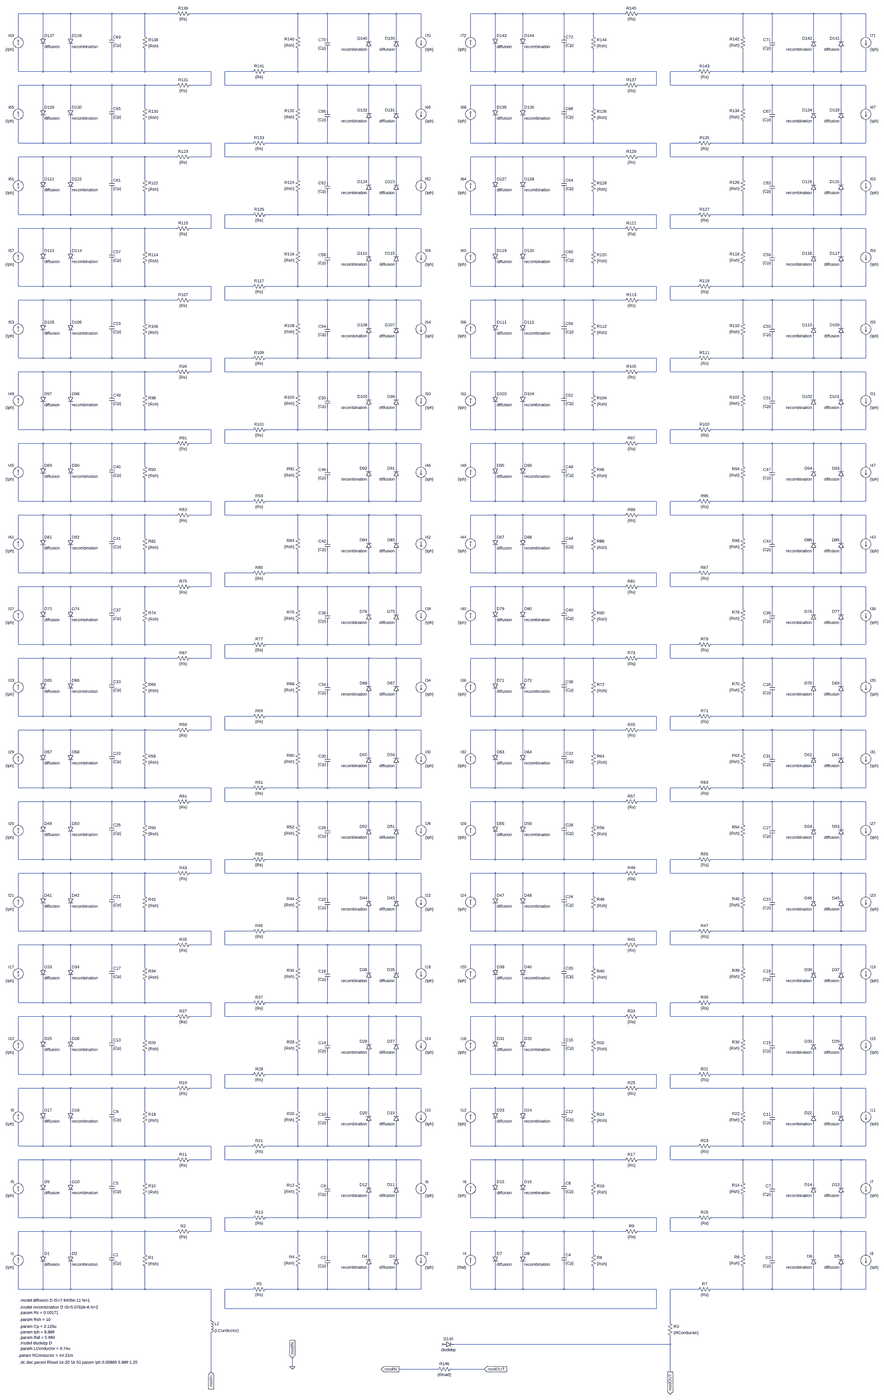
[diagram p0: schematic jacModule-IV.asc, whole sheet]
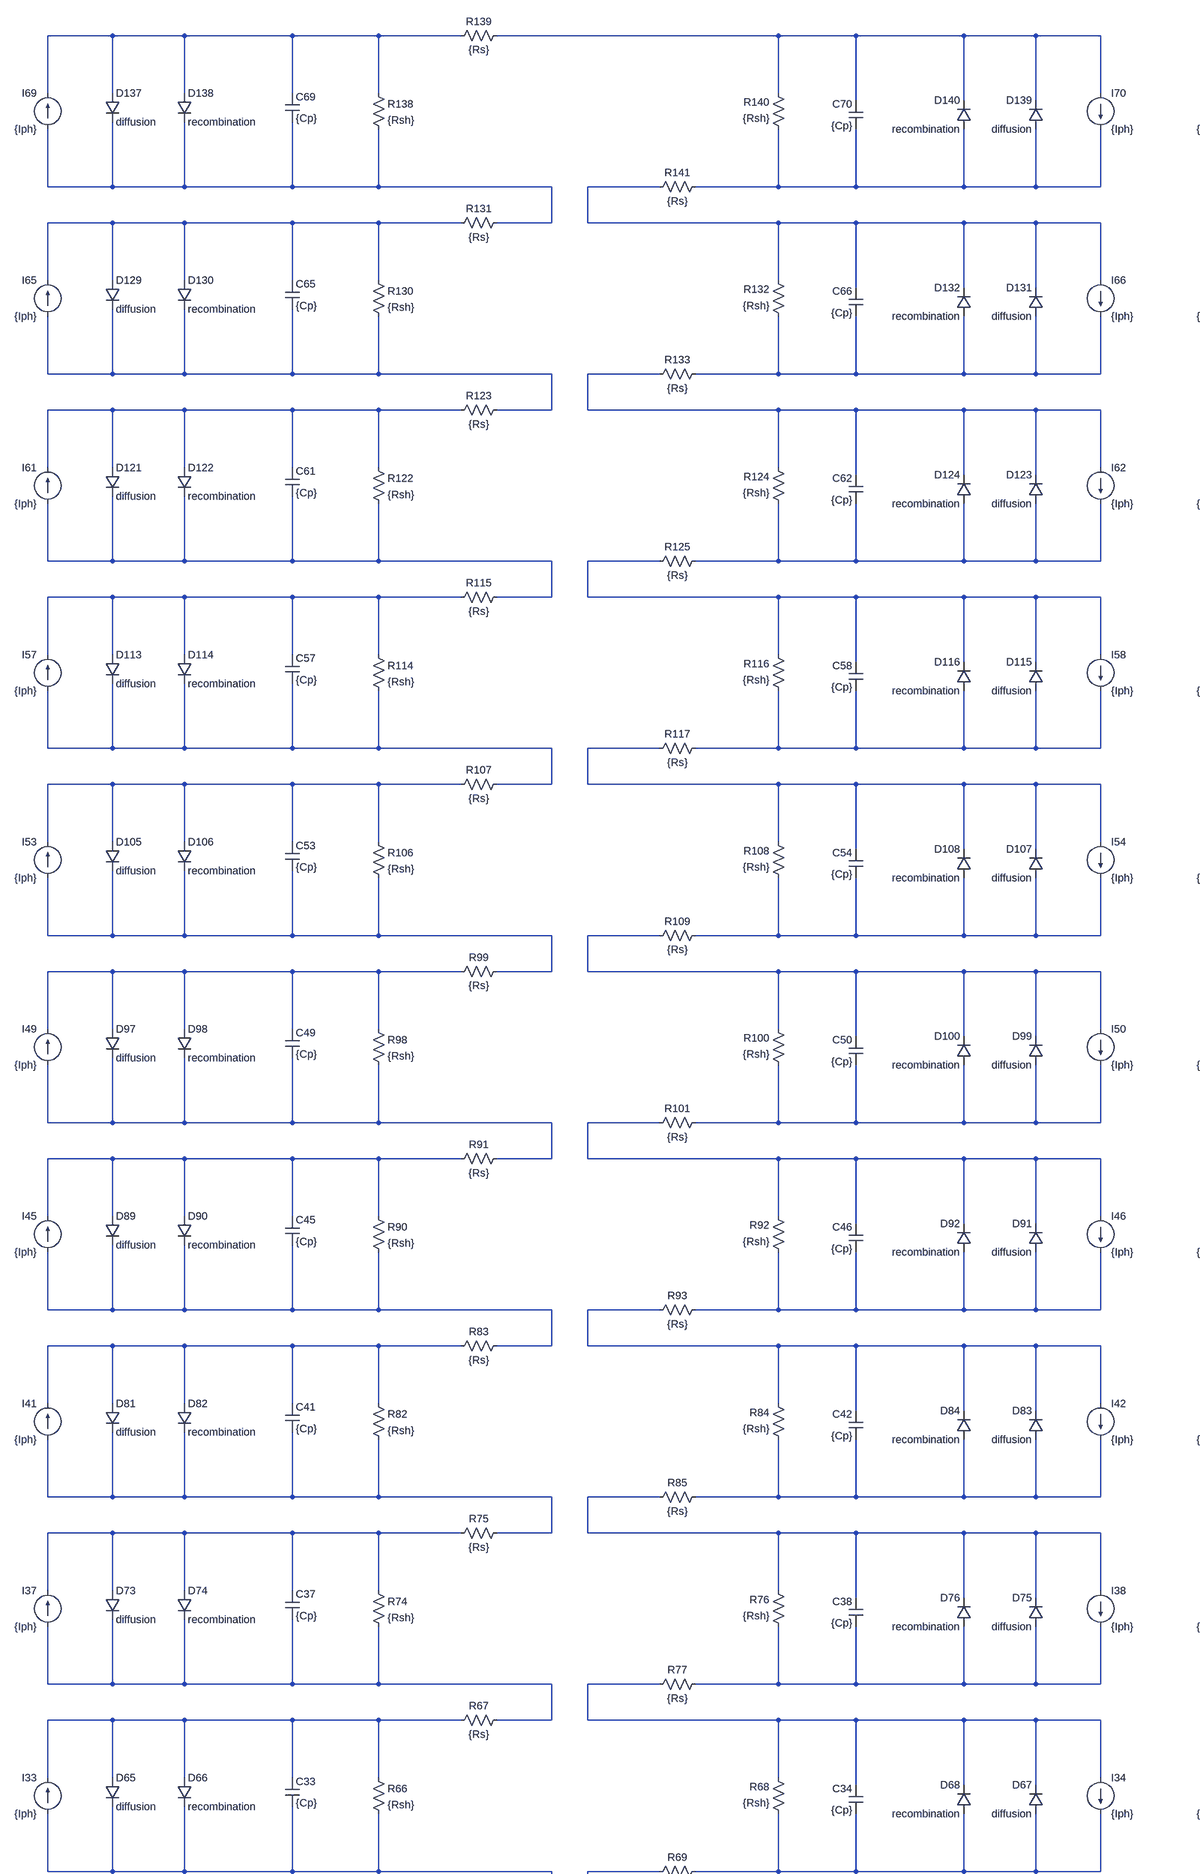
[diagram p1: schematic jacModule-IV.asc, part, row 1 of 2, column 1 of 2]
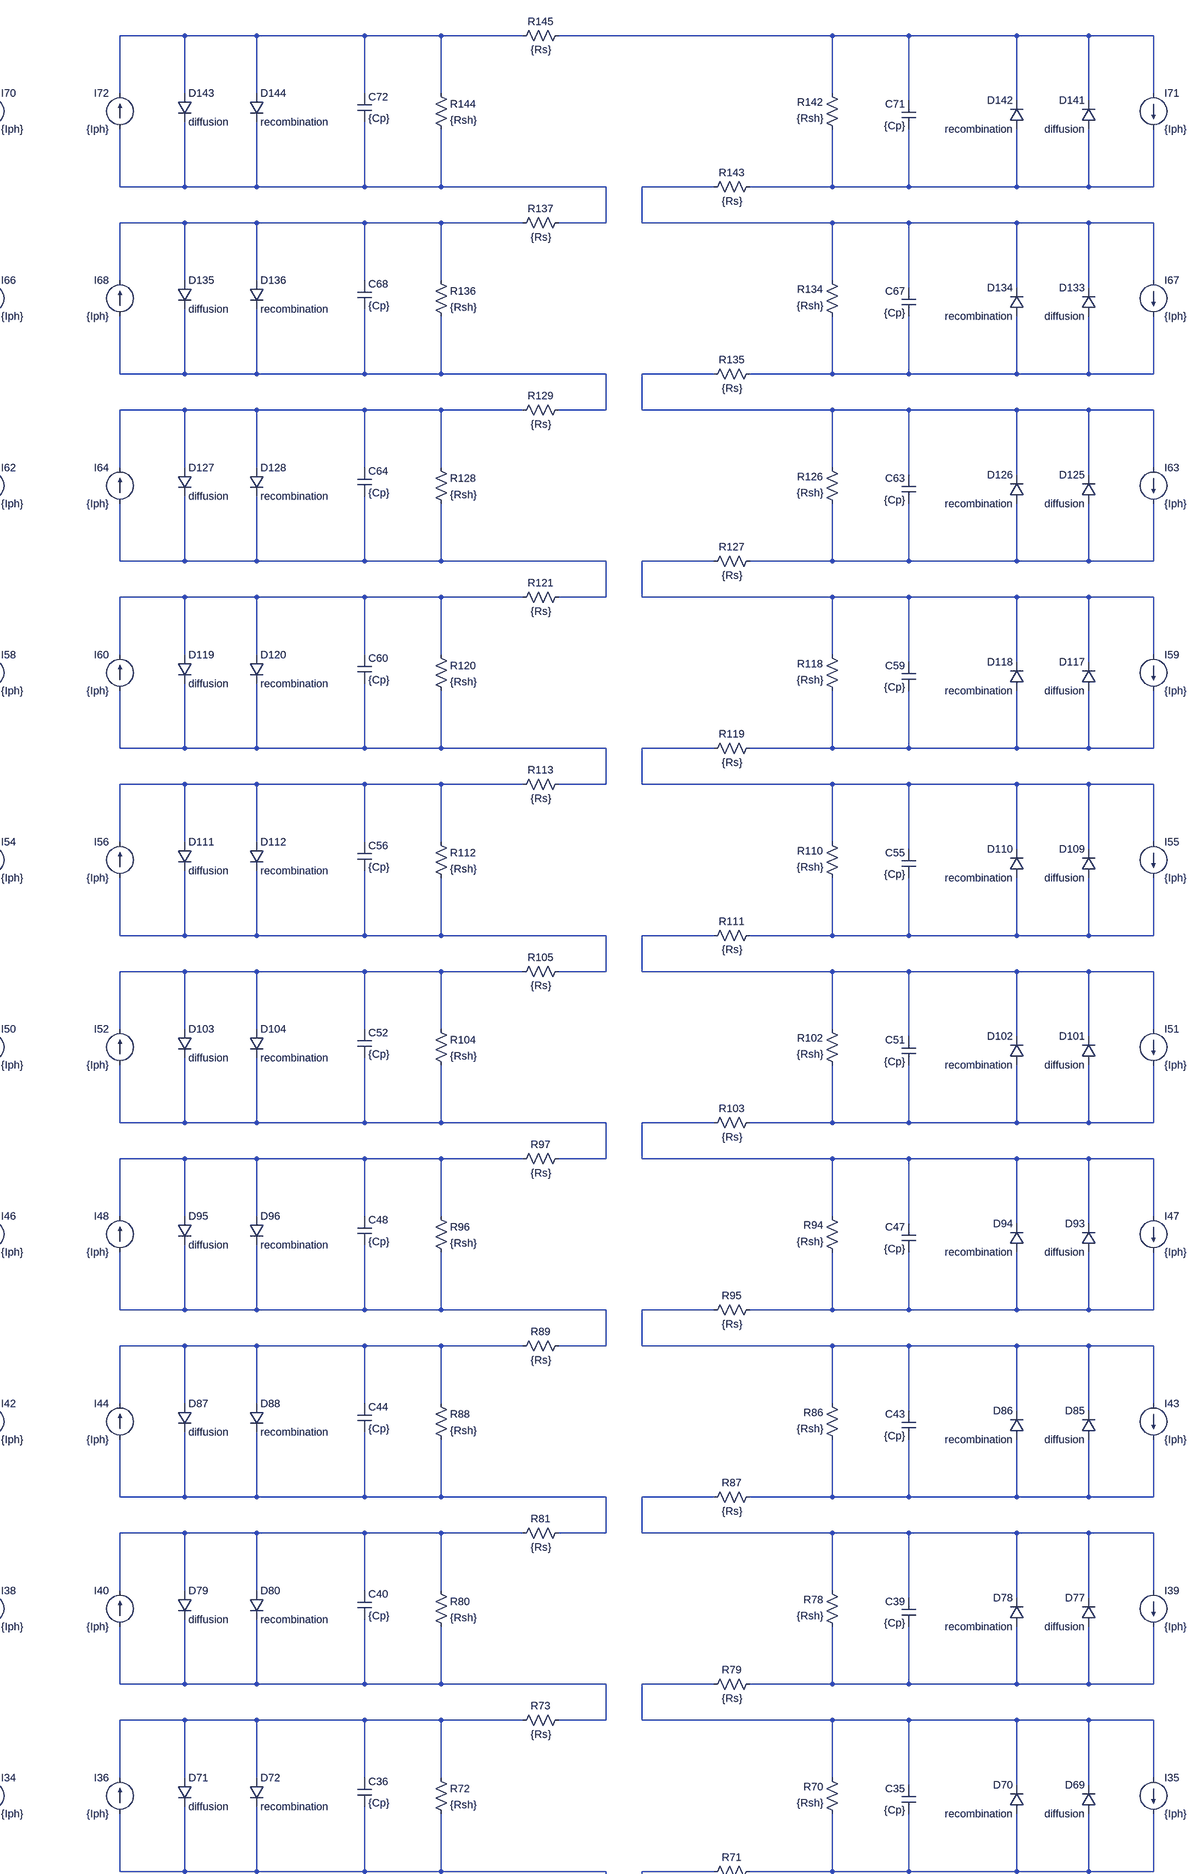
[diagram p2: schematic jacModule-IV.asc, part, row 1 of 2, column 2 of 2]
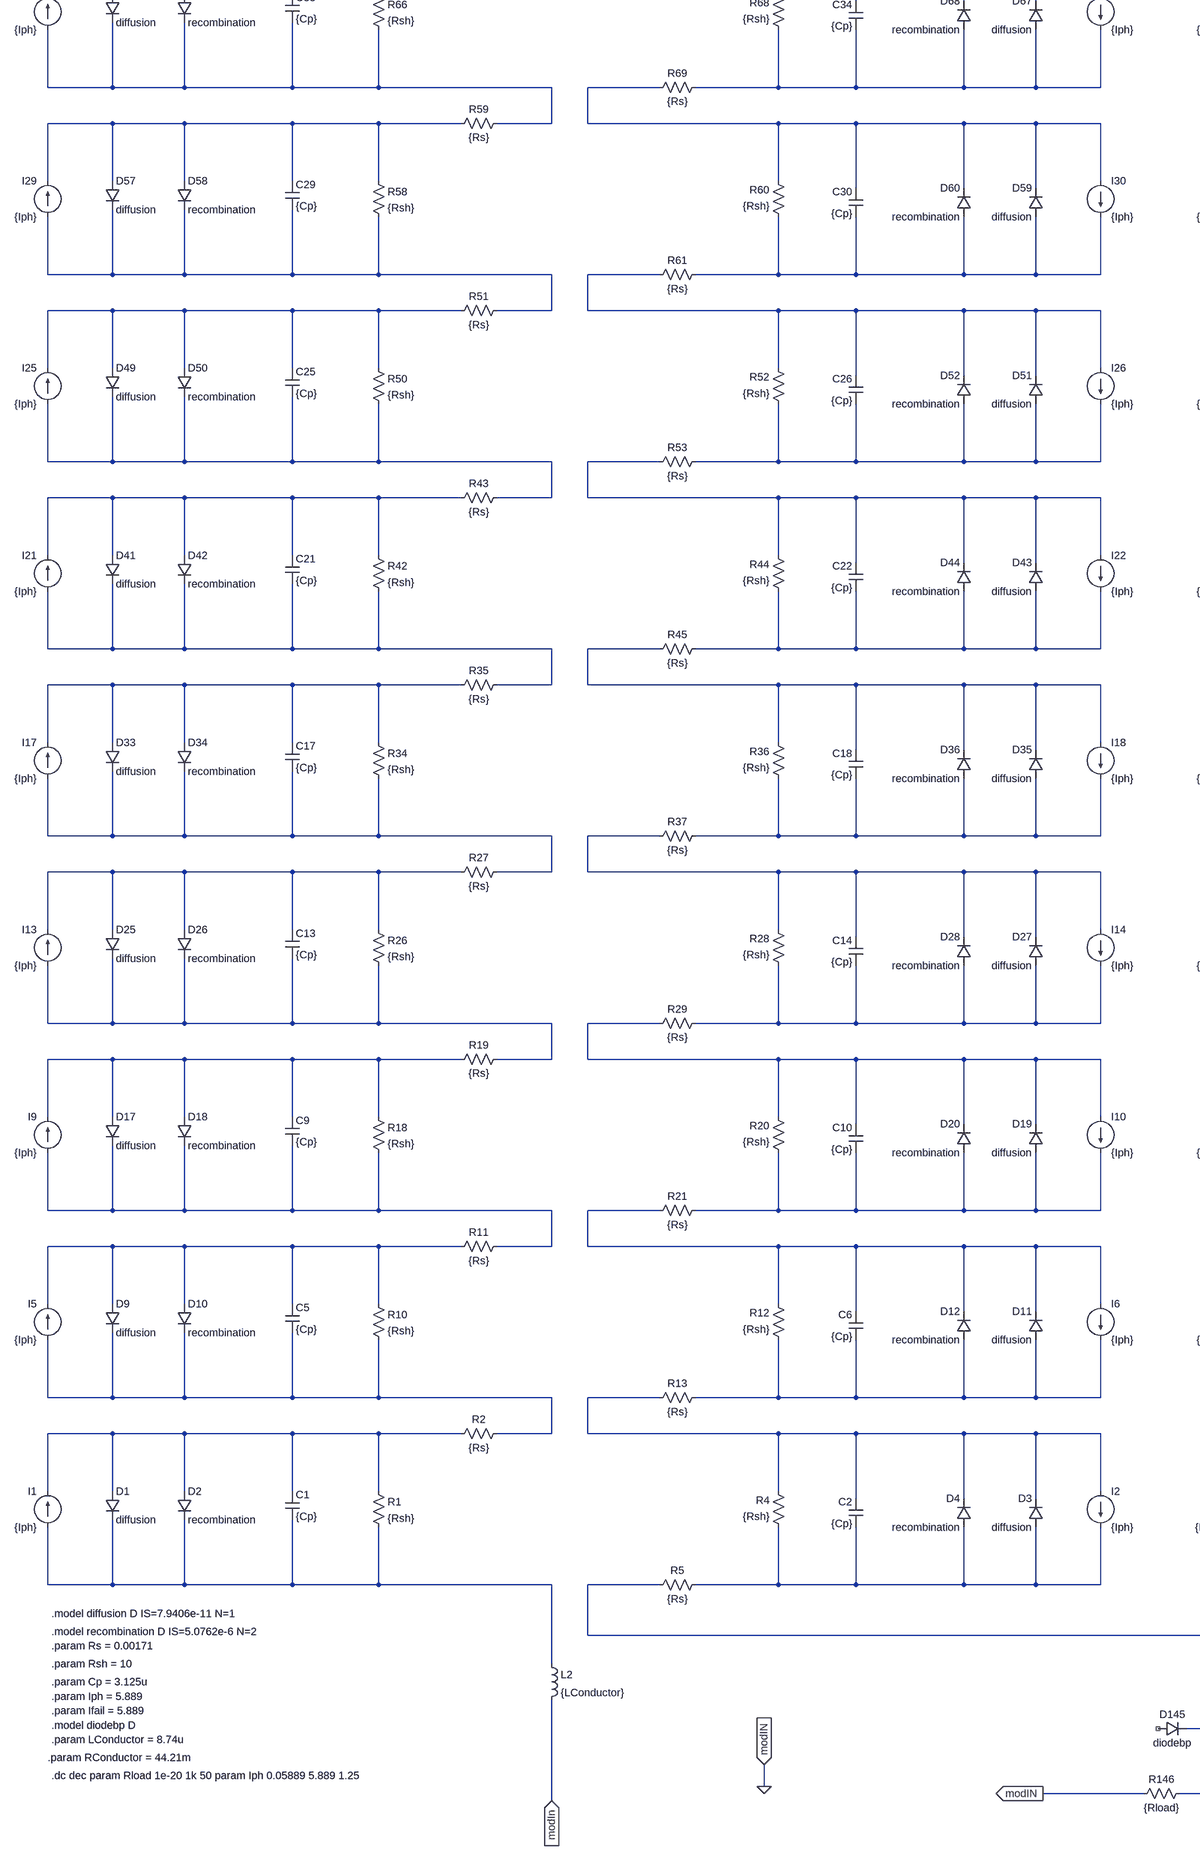
[diagram p3: schematic jacModule-IV.asc, part, row 2 of 2, column 1 of 2]
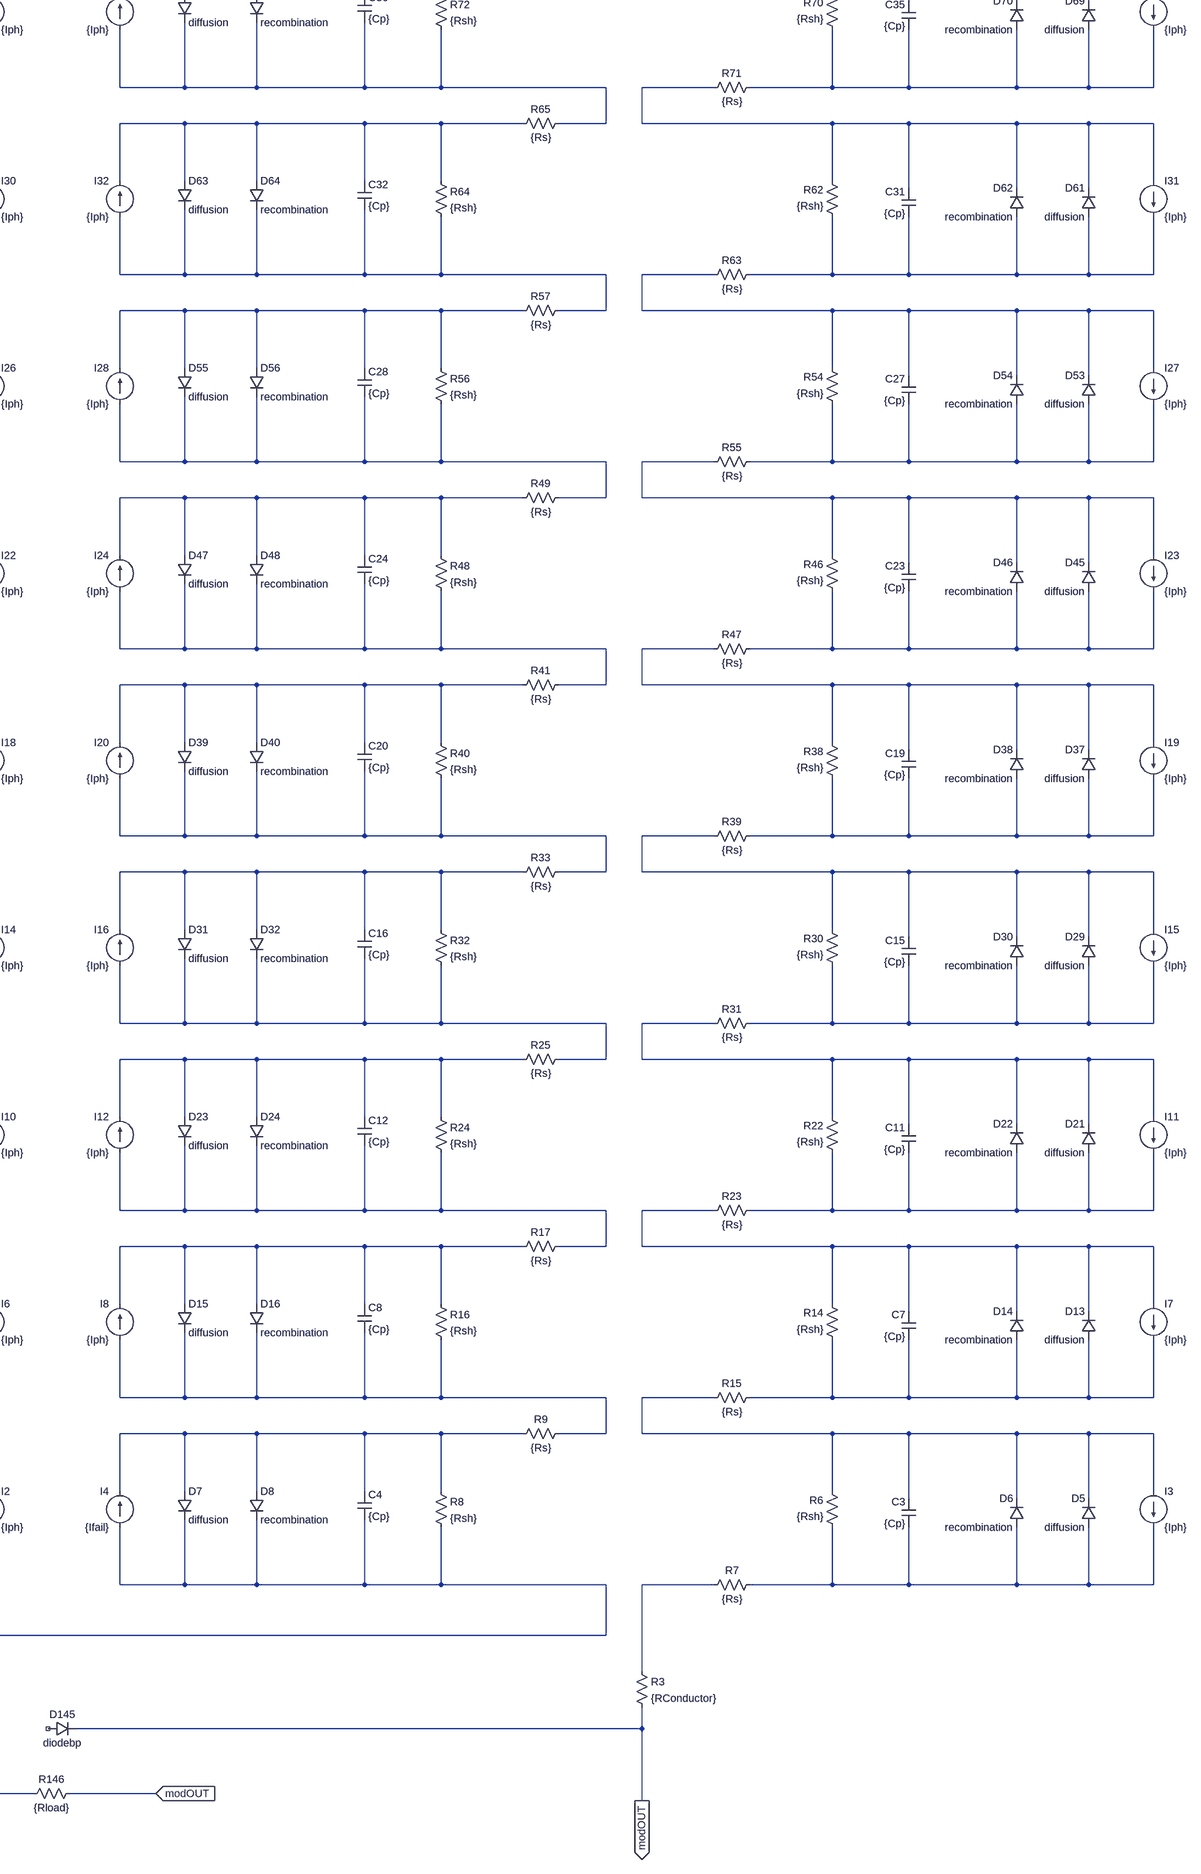
[diagram p4: schematic jacModule-IV.asc, part, row 2 of 2, column 2 of 2]
* jacModule-IV.asc
I1 N141 N139 {Iph}
D1 N139 N141 diffusion
D2 N139 N141 recombination
C1 N139 N141 {Cp}
R1 N139 N141 {Rsh}
R2 N139 N133 {Rs}
I2 N134 N143 {Iph}
D3 N143 N134 diffusion
D4 N143 N134 recombination
C2 N143 N134 {Cp}
R4 N143 N134 {Rsh}
R5 N143 N142 {Rs}
I3 N137 N145 {Iph}
D5 N145 N137 diffusion
D6 N145 N137 recombination
C3 N145 N137 {Cp}
R6 N145 N137 {Rsh}
R7 N145 N144 {Rs}
I4 N142 N140 {Ifail}
D7 N140 N142 diffusion
D8 N140 N142 recombination
C4 N140 N142 {Cp}
R8 N140 N142 {Rsh}
R9 N140 N136 {Rs}
I5 N133 N131 {Iph}
D9 N131 N133 diffusion
D10 N131 N133 recombination
C5 N131 N133 {Cp}
R10 N131 N133 {Rsh}
R11 N131 N125 {Rs}
I6 N126 N135 {Iph}
D11 N135 N126 diffusion
D12 N135 N126 recombination
C6 N135 N126 {Cp}
R12 N135 N126 {Rsh}
R13 N135 N134 {Rs}
I7 N129 N138 {Iph}
D13 N138 N129 diffusion
D14 N138 N129 recombination
C7 N138 N129 {Cp}
R14 N138 N129 {Rsh}
R15 N138 N137 {Rs}
I8 N136 N132 {Iph}
D15 N132 N136 diffusion
D16 N132 N136 recombination
C8 N132 N136 {Cp}
R16 N132 N136 {Rsh}
R17 N132 N128 {Rs}
I9 N125 N123 {Iph}
D17 N123 N125 diffusion
D18 N123 N125 recombination
C9 N123 N125 {Cp}
R18 N123 N125 {Rsh}
R19 N123 N117 {Rs}
I10 N118 N127 {Iph}
D19 N127 N118 diffusion
D20 N127 N118 recombination
C10 N127 N118 {Cp}
R20 N127 N118 {Rsh}
R21 N127 N126 {Rs}
I11 N121 N130 {Iph}
D21 N130 N121 diffusion
D22 N130 N121 recombination
C11 N130 N121 {Cp}
R22 N130 N121 {Rsh}
R23 N130 N129 {Rs}
I12 N128 N124 {Iph}
D23 N124 N128 diffusion
D24 N124 N128 recombination
C12 N124 N128 {Cp}
R24 N124 N128 {Rsh}
R25 N124 N120 {Rs}
I13 N117 N115 {Iph}
D25 N115 N117 diffusion
D26 N115 N117 recombination
C13 N115 N117 {Cp}
R26 N115 N117 {Rsh}
R27 N115 N109 {Rs}
I14 N110 N119 {Iph}
D27 N119 N110 diffusion
D28 N119 N110 recombination
C14 N119 N110 {Cp}
R28 N119 N110 {Rsh}
R29 N119 N118 {Rs}
I15 N113 N122 {Iph}
D29 N122 N113 diffusion
D30 N122 N113 recombination
C15 N122 N113 {Cp}
R30 N122 N113 {Rsh}
R31 N122 N121 {Rs}
I16 N120 N116 {Iph}
D31 N116 N120 diffusion
D32 N116 N120 recombination
C16 N116 N120 {Cp}
R32 N116 N120 {Rsh}
R33 N116 N112 {Rs}
I17 N109 N107 {Iph}
D33 N107 N109 diffusion
D34 N107 N109 recombination
C17 N107 N109 {Cp}
R34 N107 N109 {Rsh}
R35 N107 N101 {Rs}
I18 N102 N111 {Iph}
D35 N111 N102 diffusion
D36 N111 N102 recombination
C18 N111 N102 {Cp}
R36 N111 N102 {Rsh}
R37 N111 N110 {Rs}
I19 N105 N114 {Iph}
D37 N114 N105 diffusion
D38 N114 N105 recombination
C19 N114 N105 {Cp}
R38 N114 N105 {Rsh}
R39 N114 N113 {Rs}
I20 N112 N108 {Iph}
D39 N108 N112 diffusion
D40 N108 N112 recombination
C20 N108 N112 {Cp}
R40 N108 N112 {Rsh}
R41 N108 N104 {Rs}
I21 N101 N099 {Iph}
D41 N099 N101 diffusion
D42 N099 N101 recombination
C21 N099 N101 {Cp}
R42 N099 N101 {Rsh}
R43 N099 N093 {Rs}
I22 N094 N103 {Iph}
D43 N103 N094 diffusion
D44 N103 N094 recombination
C22 N103 N094 {Cp}
R44 N103 N094 {Rsh}
R45 N103 N102 {Rs}
I23 N097 N106 {Iph}
D45 N106 N097 diffusion
D46 N106 N097 recombination
C23 N106 N097 {Cp}
R46 N106 N097 {Rsh}
R47 N106 N105 {Rs}
I24 N104 N100 {Iph}
D47 N100 N104 diffusion
D48 N100 N104 recombination
C24 N100 N104 {Cp}
R48 N100 N104 {Rsh}
R49 N100 N096 {Rs}
I25 N093 N091 {Iph}
D49 N091 N093 diffusion
D50 N091 N093 recombination
C25 N091 N093 {Cp}
R50 N091 N093 {Rsh}
R51 N091 N085 {Rs}
I26 N086 N095 {Iph}
D51 N095 N086 diffusion
D52 N095 N086 recombination
C26 N095 N086 {Cp}
R52 N095 N086 {Rsh}
R53 N095 N094 {Rs}
I27 N089 N098 {Iph}
D53 N098 N089 diffusion
D54 N098 N089 recombination
C27 N098 N089 {Cp}
R54 N098 N089 {Rsh}
R55 N098 N097 {Rs}
I28 N096 N092 {Iph}
D55 N092 N096 diffusion
D56 N092 N096 recombination
C28 N092 N096 {Cp}
R56 N092 N096 {Rsh}
R57 N092 N088 {Rs}
I29 N085 N083 {Iph}
D57 N083 N085 diffusion
D58 N083 N085 recombination
C29 N083 N085 {Cp}
R58 N083 N085 {Rsh}
R59 N083 N077 {Rs}
I30 N078 N087 {Iph}
D59 N087 N078 diffusion
D60 N087 N078 recombination
C30 N087 N078 {Cp}
R60 N087 N078 {Rsh}
R61 N087 N086 {Rs}
I31 N081 N090 {Iph}
D61 N090 N081 diffusion
D62 N090 N081 recombination
C31 N090 N081 {Cp}
R62 N090 N081 {Rsh}
R63 N090 N089 {Rs}
I32 N088 N084 {Iph}
D63 N084 N088 diffusion
D64 N084 N088 recombination
C32 N084 N088 {Cp}
R64 N084 N088 {Rsh}
R65 N084 N080 {Rs}
I33 N077 N075 {Iph}
D65 N075 N077 diffusion
D66 N075 N077 recombination
C33 N075 N077 {Cp}
R66 N075 N077 {Rsh}
R67 N075 N069 {Rs}
I34 N070 N079 {Iph}
D67 N079 N070 diffusion
D68 N079 N070 recombination
C34 N079 N070 {Cp}
R68 N079 N070 {Rsh}
R69 N079 N078 {Rs}
I35 N073 N082 {Iph}
D69 N082 N073 diffusion
D70 N082 N073 recombination
C35 N082 N073 {Cp}
R70 N082 N073 {Rsh}
R71 N082 N081 {Rs}
I36 N080 N076 {Iph}
D71 N076 N080 diffusion
D72 N076 N080 recombination
C36 N076 N080 {Cp}
R72 N076 N080 {Rsh}
R73 N076 N072 {Rs}
I37 N069 N067 {Iph}
D73 N067 N069 diffusion
D74 N067 N069 recombination
C37 N067 N069 {Cp}
R74 N067 N069 {Rsh}
R75 N067 N061 {Rs}
I38 N062 N071 {Iph}
D75 N071 N062 diffusion
D76 N071 N062 recombination
C38 N071 N062 {Cp}
R76 N071 N062 {Rsh}
R77 N071 N070 {Rs}
I39 N065 N074 {Iph}
D77 N074 N065 diffusion
D78 N074 N065 recombination
C39 N074 N065 {Cp}
R78 N074 N065 {Rsh}
R79 N074 N073 {Rs}
I40 N072 N068 {Iph}
D79 N068 N072 diffusion
D80 N068 N072 recombination
C40 N068 N072 {Cp}
R80 N068 N072 {Rsh}
R81 N068 N064 {Rs}
I41 N061 N059 {Iph}
D81 N059 N061 diffusion
D82 N059 N061 recombination
C41 N059 N061 {Cp}
R82 N059 N061 {Rsh}
R83 N059 N053 {Rs}
I42 N054 N063 {Iph}
D83 N063 N054 diffusion
D84 N063 N054 recombination
C42 N063 N054 {Cp}
R84 N063 N054 {Rsh}
R85 N063 N062 {Rs}
I43 N057 N066 {Iph}
D85 N066 N057 diffusion
D86 N066 N057 recombination
C43 N066 N057 {Cp}
R86 N066 N057 {Rsh}
R87 N066 N065 {Rs}
I44 N064 N060 {Iph}
D87 N060 N064 diffusion
D88 N060 N064 recombination
C44 N060 N064 {Cp}
R88 N060 N064 {Rsh}
R89 N060 N056 {Rs}
I45 N053 N051 {Iph}
D89 N051 N053 diffusion
D90 N051 N053 recombination
C45 N051 N053 {Cp}
R90 N051 N053 {Rsh}
R91 N051 N045 {Rs}
I46 N046 N055 {Iph}
D91 N055 N046 diffusion
D92 N055 N046 recombination
C46 N055 N046 {Cp}
R92 N055 N046 {Rsh}
R93 N055 N054 {Rs}
I47 N049 N058 {Iph}
D93 N058 N049 diffusion
D94 N058 N049 recombination
C47 N058 N049 {Cp}
R94 N058 N049 {Rsh}
R95 N058 N057 {Rs}
I48 N056 N052 {Iph}
D95 N052 N056 diffusion
D96 N052 N056 recombination
C48 N052 N056 {Cp}
R96 N052 N056 {Rsh}
R97 N052 N048 {Rs}
I49 N045 N043 {Iph}
D97 N043 N045 diffusion
D98 N043 N045 recombination
C49 N043 N045 {Cp}
R98 N043 N045 {Rsh}
R99 N043 N037 {Rs}
I50 N038 N047 {Iph}
D99 N047 N038 diffusion
D100 N047 N038 recombination
C50 N047 N038 {Cp}
R100 N047 N038 {Rsh}
R101 N047 N046 {Rs}
I51 N041 N050 {Iph}
D101 N050 N041 diffusion
D102 N050 N041 recombination
C51 N050 N041 {Cp}
R102 N050 N041 {Rsh}
R103 N050 N049 {Rs}
I52 N048 N044 {Iph}
D103 N044 N048 diffusion
D104 N044 N048 recombination
C52 N044 N048 {Cp}
R104 N044 N048 {Rsh}
R105 N044 N040 {Rs}
I53 N037 N035 {Iph}
D105 N035 N037 diffusion
D106 N035 N037 recombination
C53 N035 N037 {Cp}
R106 N035 N037 {Rsh}
R107 N035 N029 {Rs}
I54 N030 N039 {Iph}
D107 N039 N030 diffusion
D108 N039 N030 recombination
C54 N039 N030 {Cp}
R108 N039 N030 {Rsh}
R109 N039 N038 {Rs}
I55 N033 N042 {Iph}
D109 N042 N033 diffusion
D110 N042 N033 recombination
C55 N042 N033 {Cp}
R110 N042 N033 {Rsh}
R111 N042 N041 {Rs}
I56 N040 N036 {Iph}
D111 N036 N040 diffusion
D112 N036 N040 recombination
C56 N036 N040 {Cp}
R112 N036 N040 {Rsh}
R113 N036 N032 {Rs}
I57 N029 N027 {Iph}
D113 N027 N029 diffusion
D114 N027 N029 recombination
C57 N027 N029 {Cp}
R114 N027 N029 {Rsh}
R115 N027 N021 {Rs}
I58 N022 N031 {Iph}
D115 N031 N022 diffusion
D116 N031 N022 recombination
C58 N031 N022 {Cp}
R116 N031 N022 {Rsh}
R117 N031 N030 {Rs}
I59 N025 N034 {Iph}
D117 N034 N025 diffusion
D118 N034 N025 recombination
C59 N034 N025 {Cp}
R118 N034 N025 {Rsh}
R119 N034 N033 {Rs}
I60 N032 N028 {Iph}
D119 N028 N032 diffusion
D120 N028 N032 recombination
C60 N028 N032 {Cp}
R120 N028 N032 {Rsh}
R121 N028 N024 {Rs}
I61 N021 N019 {Iph}
D121 N019 N021 diffusion
D122 N019 N021 recombination
C61 N019 N021 {Cp}
R122 N019 N021 {Rsh}
R123 N019 N013 {Rs}
I62 N014 N023 {Iph}
D123 N023 N014 diffusion
D124 N023 N014 recombination
C62 N023 N014 {Cp}
R124 N023 N014 {Rsh}
R125 N023 N022 {Rs}
I63 N017 N026 {Iph}
D125 N026 N017 diffusion
D126 N026 N017 recombination
C63 N026 N017 {Cp}
R126 N026 N017 {Rsh}
R127 N026 N025 {Rs}
I64 N024 N020 {Iph}
D127 N020 N024 diffusion
D128 N020 N024 recombination
C64 N020 N024 {Cp}
R128 N020 N024 {Rsh}
R129 N020 N016 {Rs}
I65 N013 N011 {Iph}
D129 N011 N013 diffusion
D130 N011 N013 recombination
C65 N011 N013 {Cp}
R130 N011 N013 {Rsh}
R131 N011 N005 {Rs}
I66 N006 N015 {Iph}
D131 N015 N006 diffusion
D132 N015 N006 recombination
C66 N015 N006 {Cp}
R132 N015 N006 {Rsh}
R133 N015 N014 {Rs}
I67 N009 N018 {Iph}
D133 N018 N009 diffusion
D134 N018 N009 recombination
C67 N018 N009 {Cp}
R134 N018 N009 {Rsh}
R135 N018 N017 {Rs}
I68 N016 N012 {Iph}
D135 N012 N016 diffusion
D136 N012 N016 recombination
C68 N012 N016 {Cp}
R136 N012 N016 {Rsh}
R137 N012 N008 {Rs}
I69 N005 N001 {Iph}
D137 N001 N005 diffusion
D138 N001 N005 recombination
C69 N001 N005 {Cp}
R138 N001 N005 {Rsh}
R139 N001 N002 {Rs}
I70 N002 N007 {Iph}
D139 N007 N002 diffusion
D140 N007 N002 recombination
C70 N007 N002 {Cp}
R140 N007 N002 {Rsh}
R141 N007 N006 {Rs}
I71 N004 N010 {Iph}
D141 N010 N004 diffusion
D142 N010 N004 recombination
C71 N010 N004 {Cp}
R142 N010 N004 {Rsh}
R143 N010 N009 {Rs}
I72 N008 N003 {Iph}
D143 N003 N008 diffusion
D144 N003 N008 recombination
C72 N003 N008 {Cp}
R144 N003 N008 {Rsh}
R145 N003 N004 {Rs}
D145 NC_01 modOUT diodebp
L2 N141 0 {LConductor}
R3 N144 modOUT {RConductor}
R146 modOUT 0 {Rload}
.model D D
.lib standard.dio
.model diffusion D IS=7.9406e-11 N=1
.model recombination D IS=5.0762e-6 N=2
.param Rs = 0.00171
.param Rsh = 10
.param Cp = 3.125u
.param Iph = 5.889
.param Ifail = 5.889
.model diodebp D
.param LConductor = 8.74u
.param RConductor = 44.21m
.dc dec param Rload 1e-20 1k 50 param Iph 0.05889 5.889 1.25
.backanno
.end